# EasyEDA schematic SCH_d_01_ex_01.json

## Sheets
1 EX01_0: TITLE: Sheet_1; REV: 1.0; Date: 2025-01-14; Sheet: 1/1; Drawn By: artem.v.ulyanov; Company: Your Company
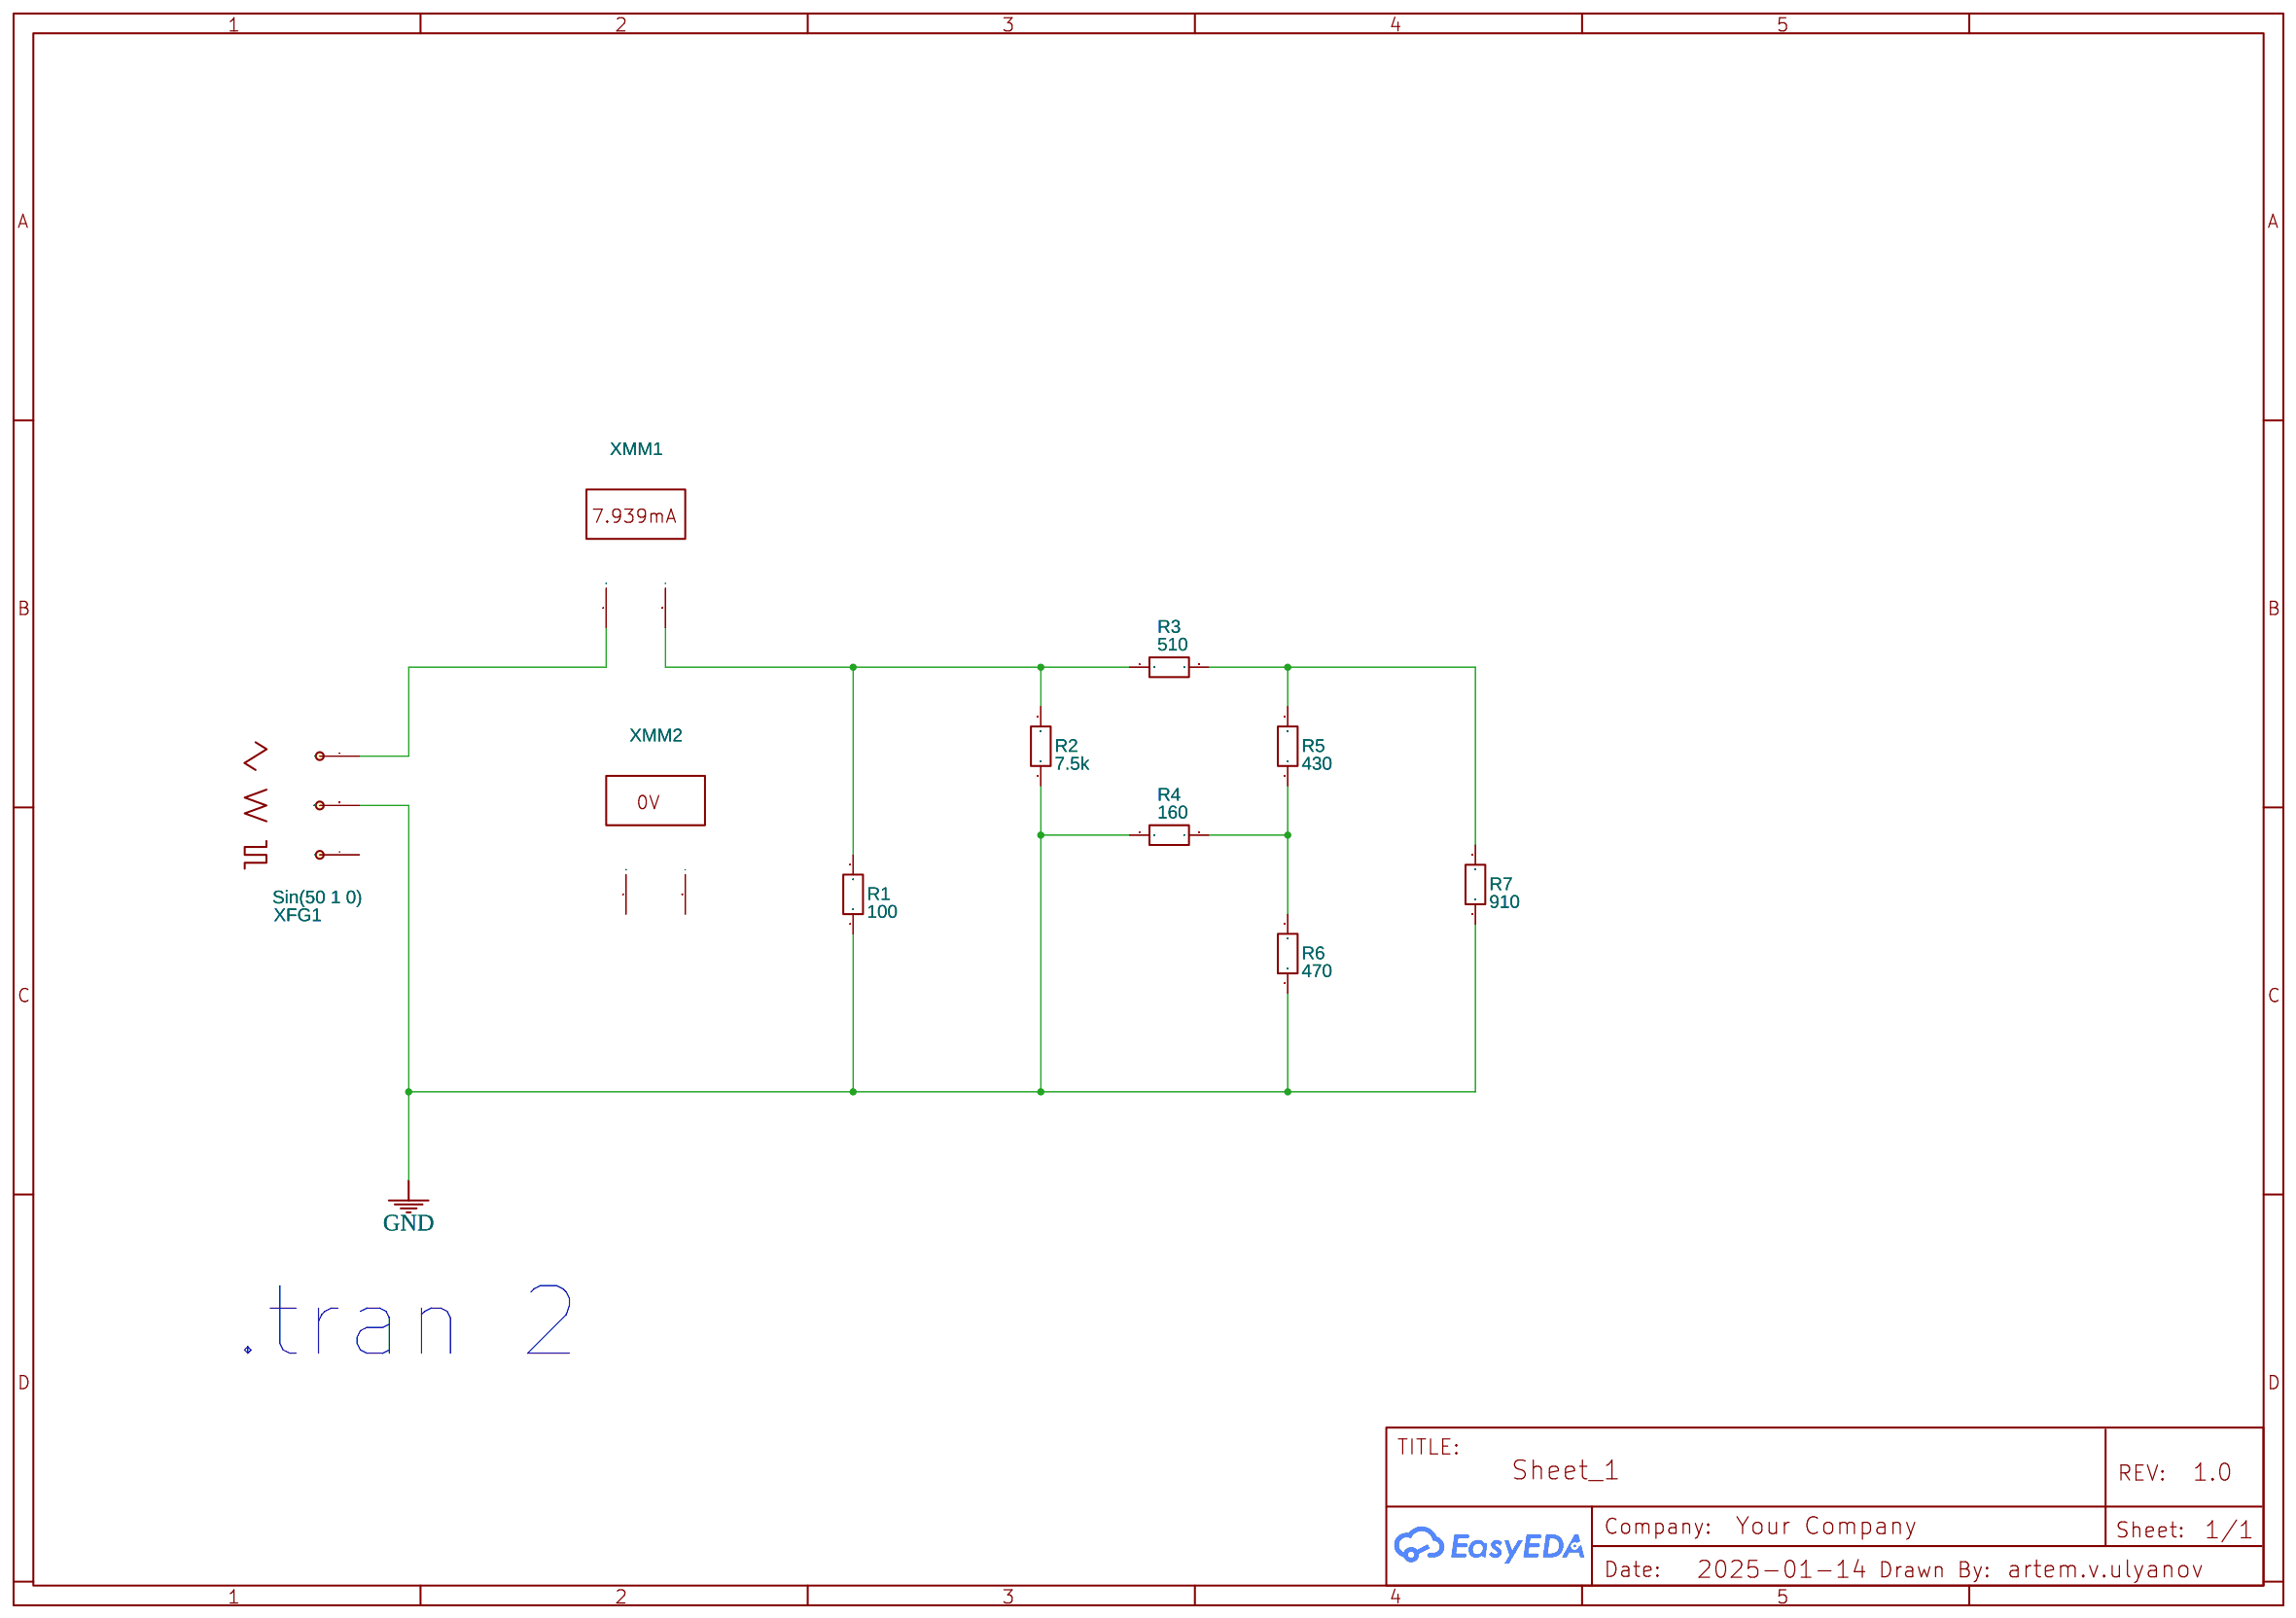
[diagram p0: EX01_0]
2 EX01_1
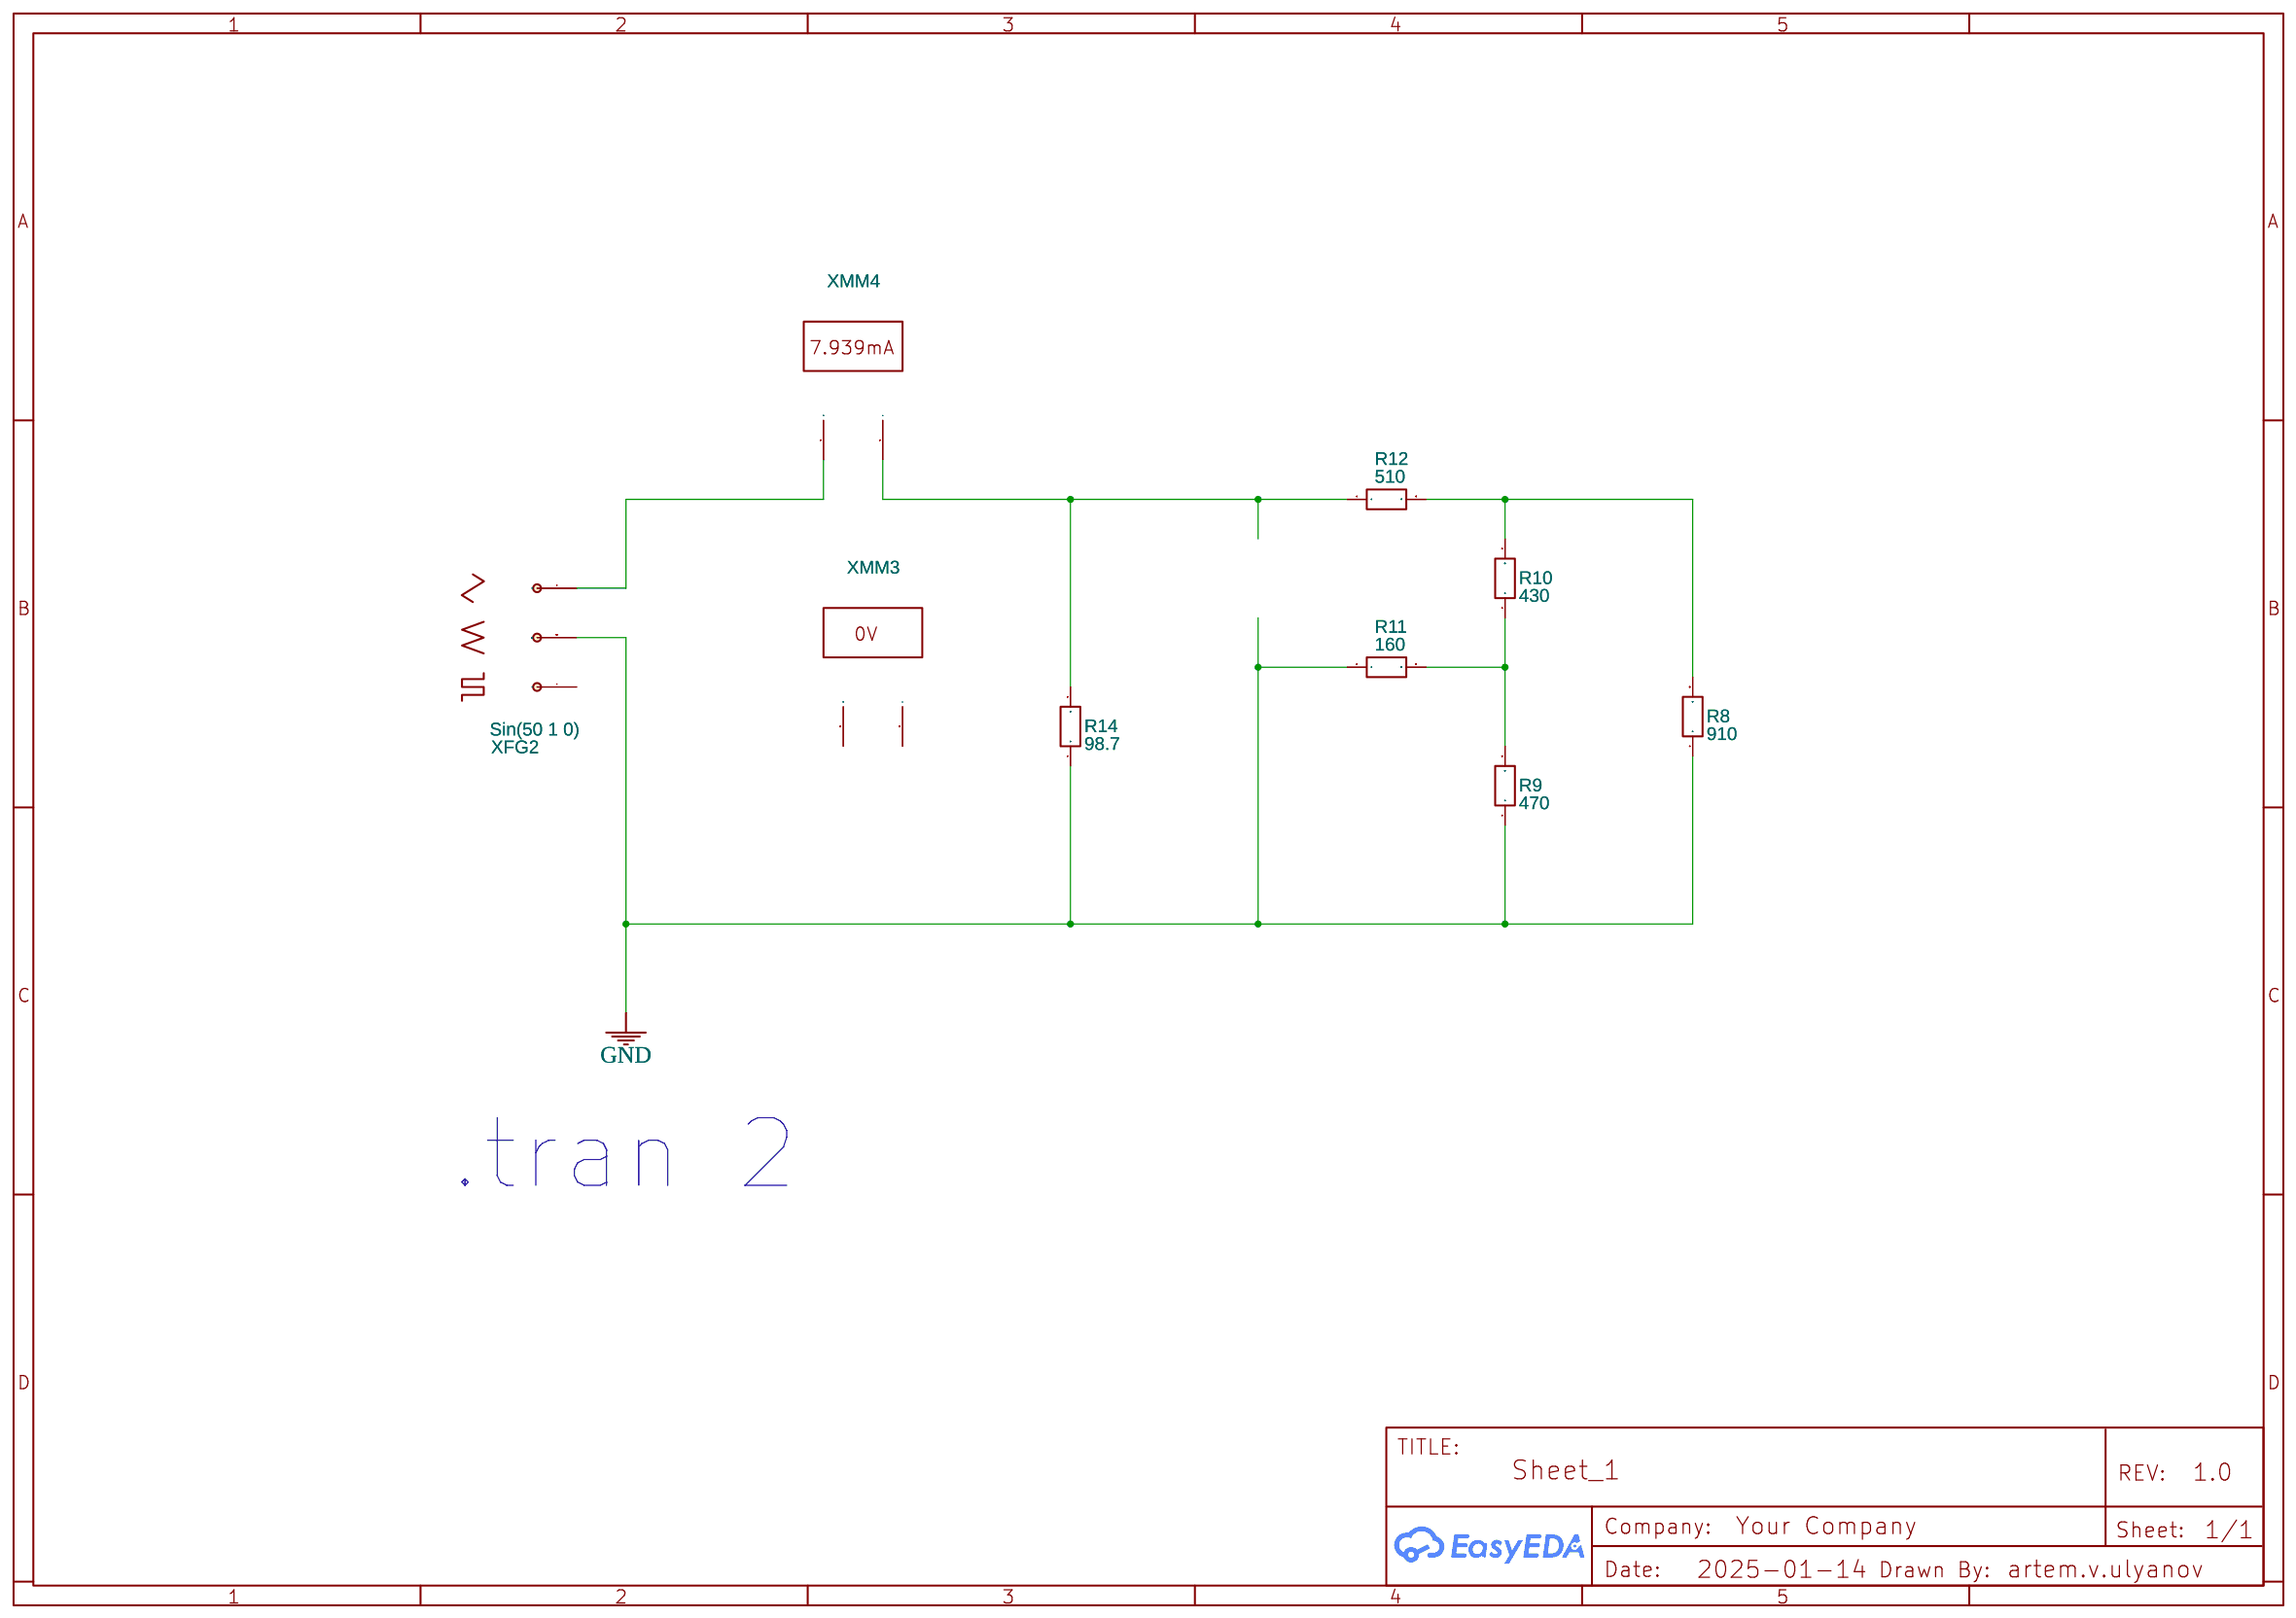
[diagram p1: EX01_1]
3 EX01_2
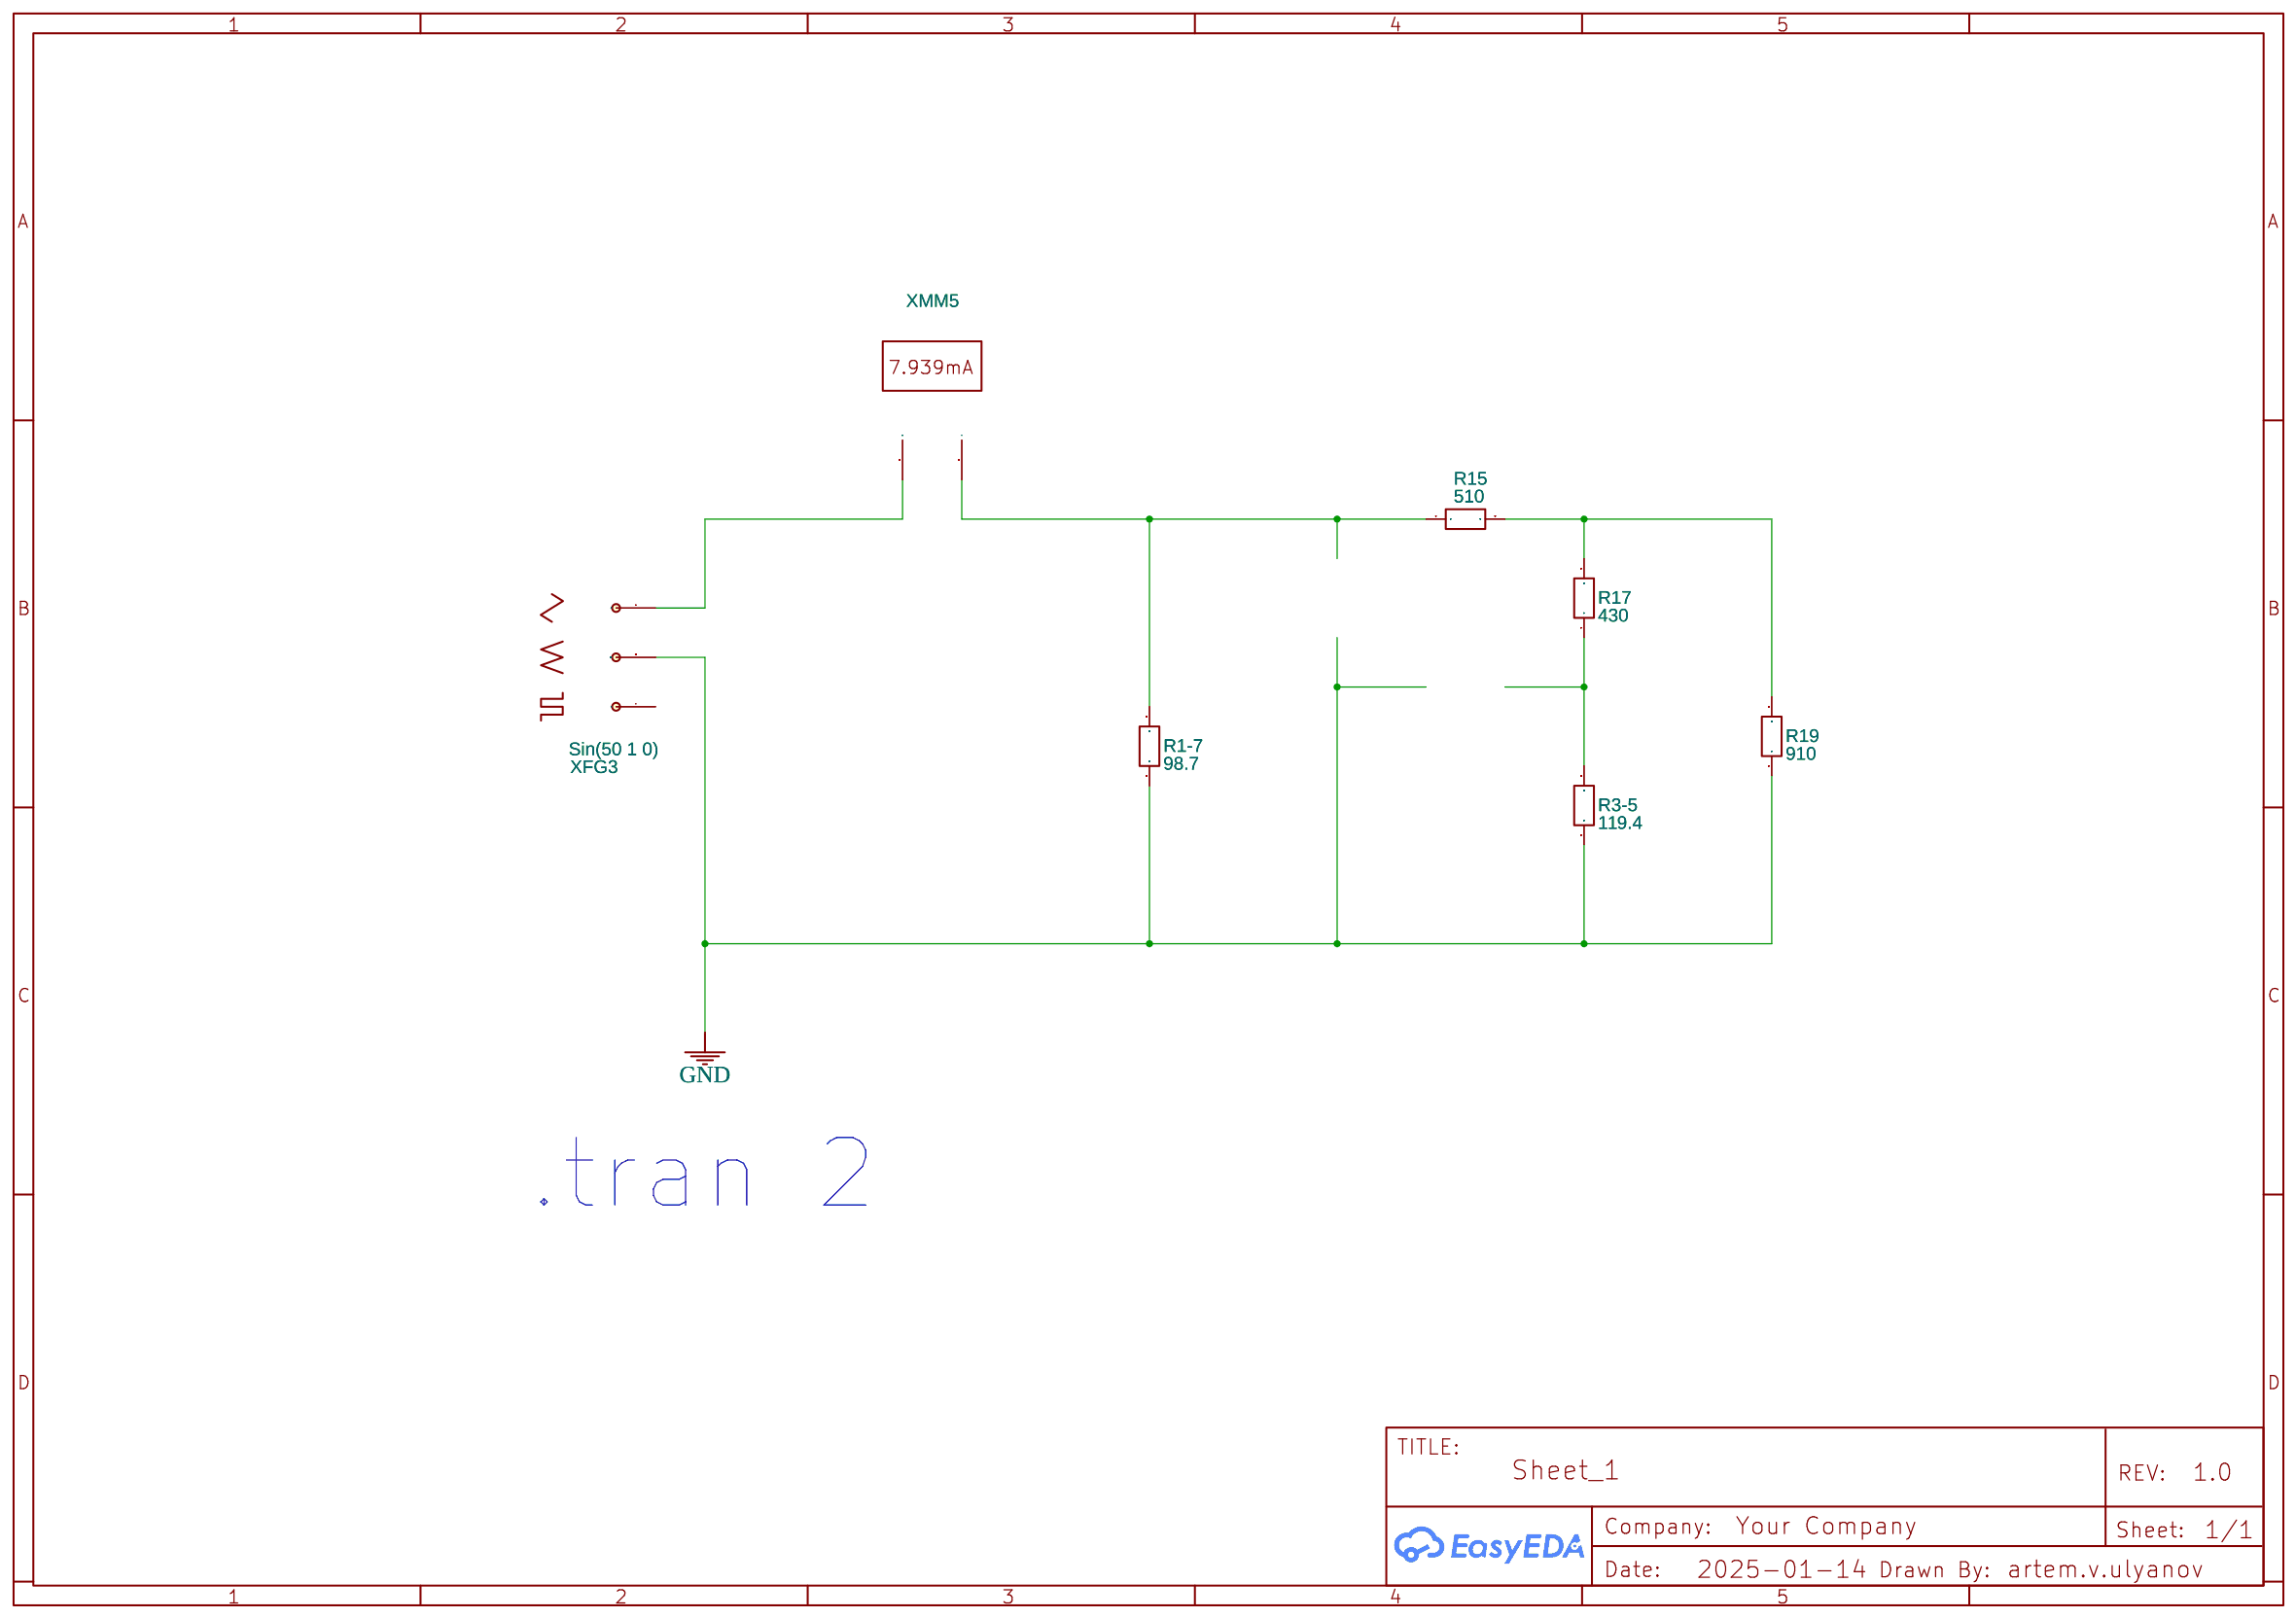
[diagram p2: EX01_2]
4 EX01_3
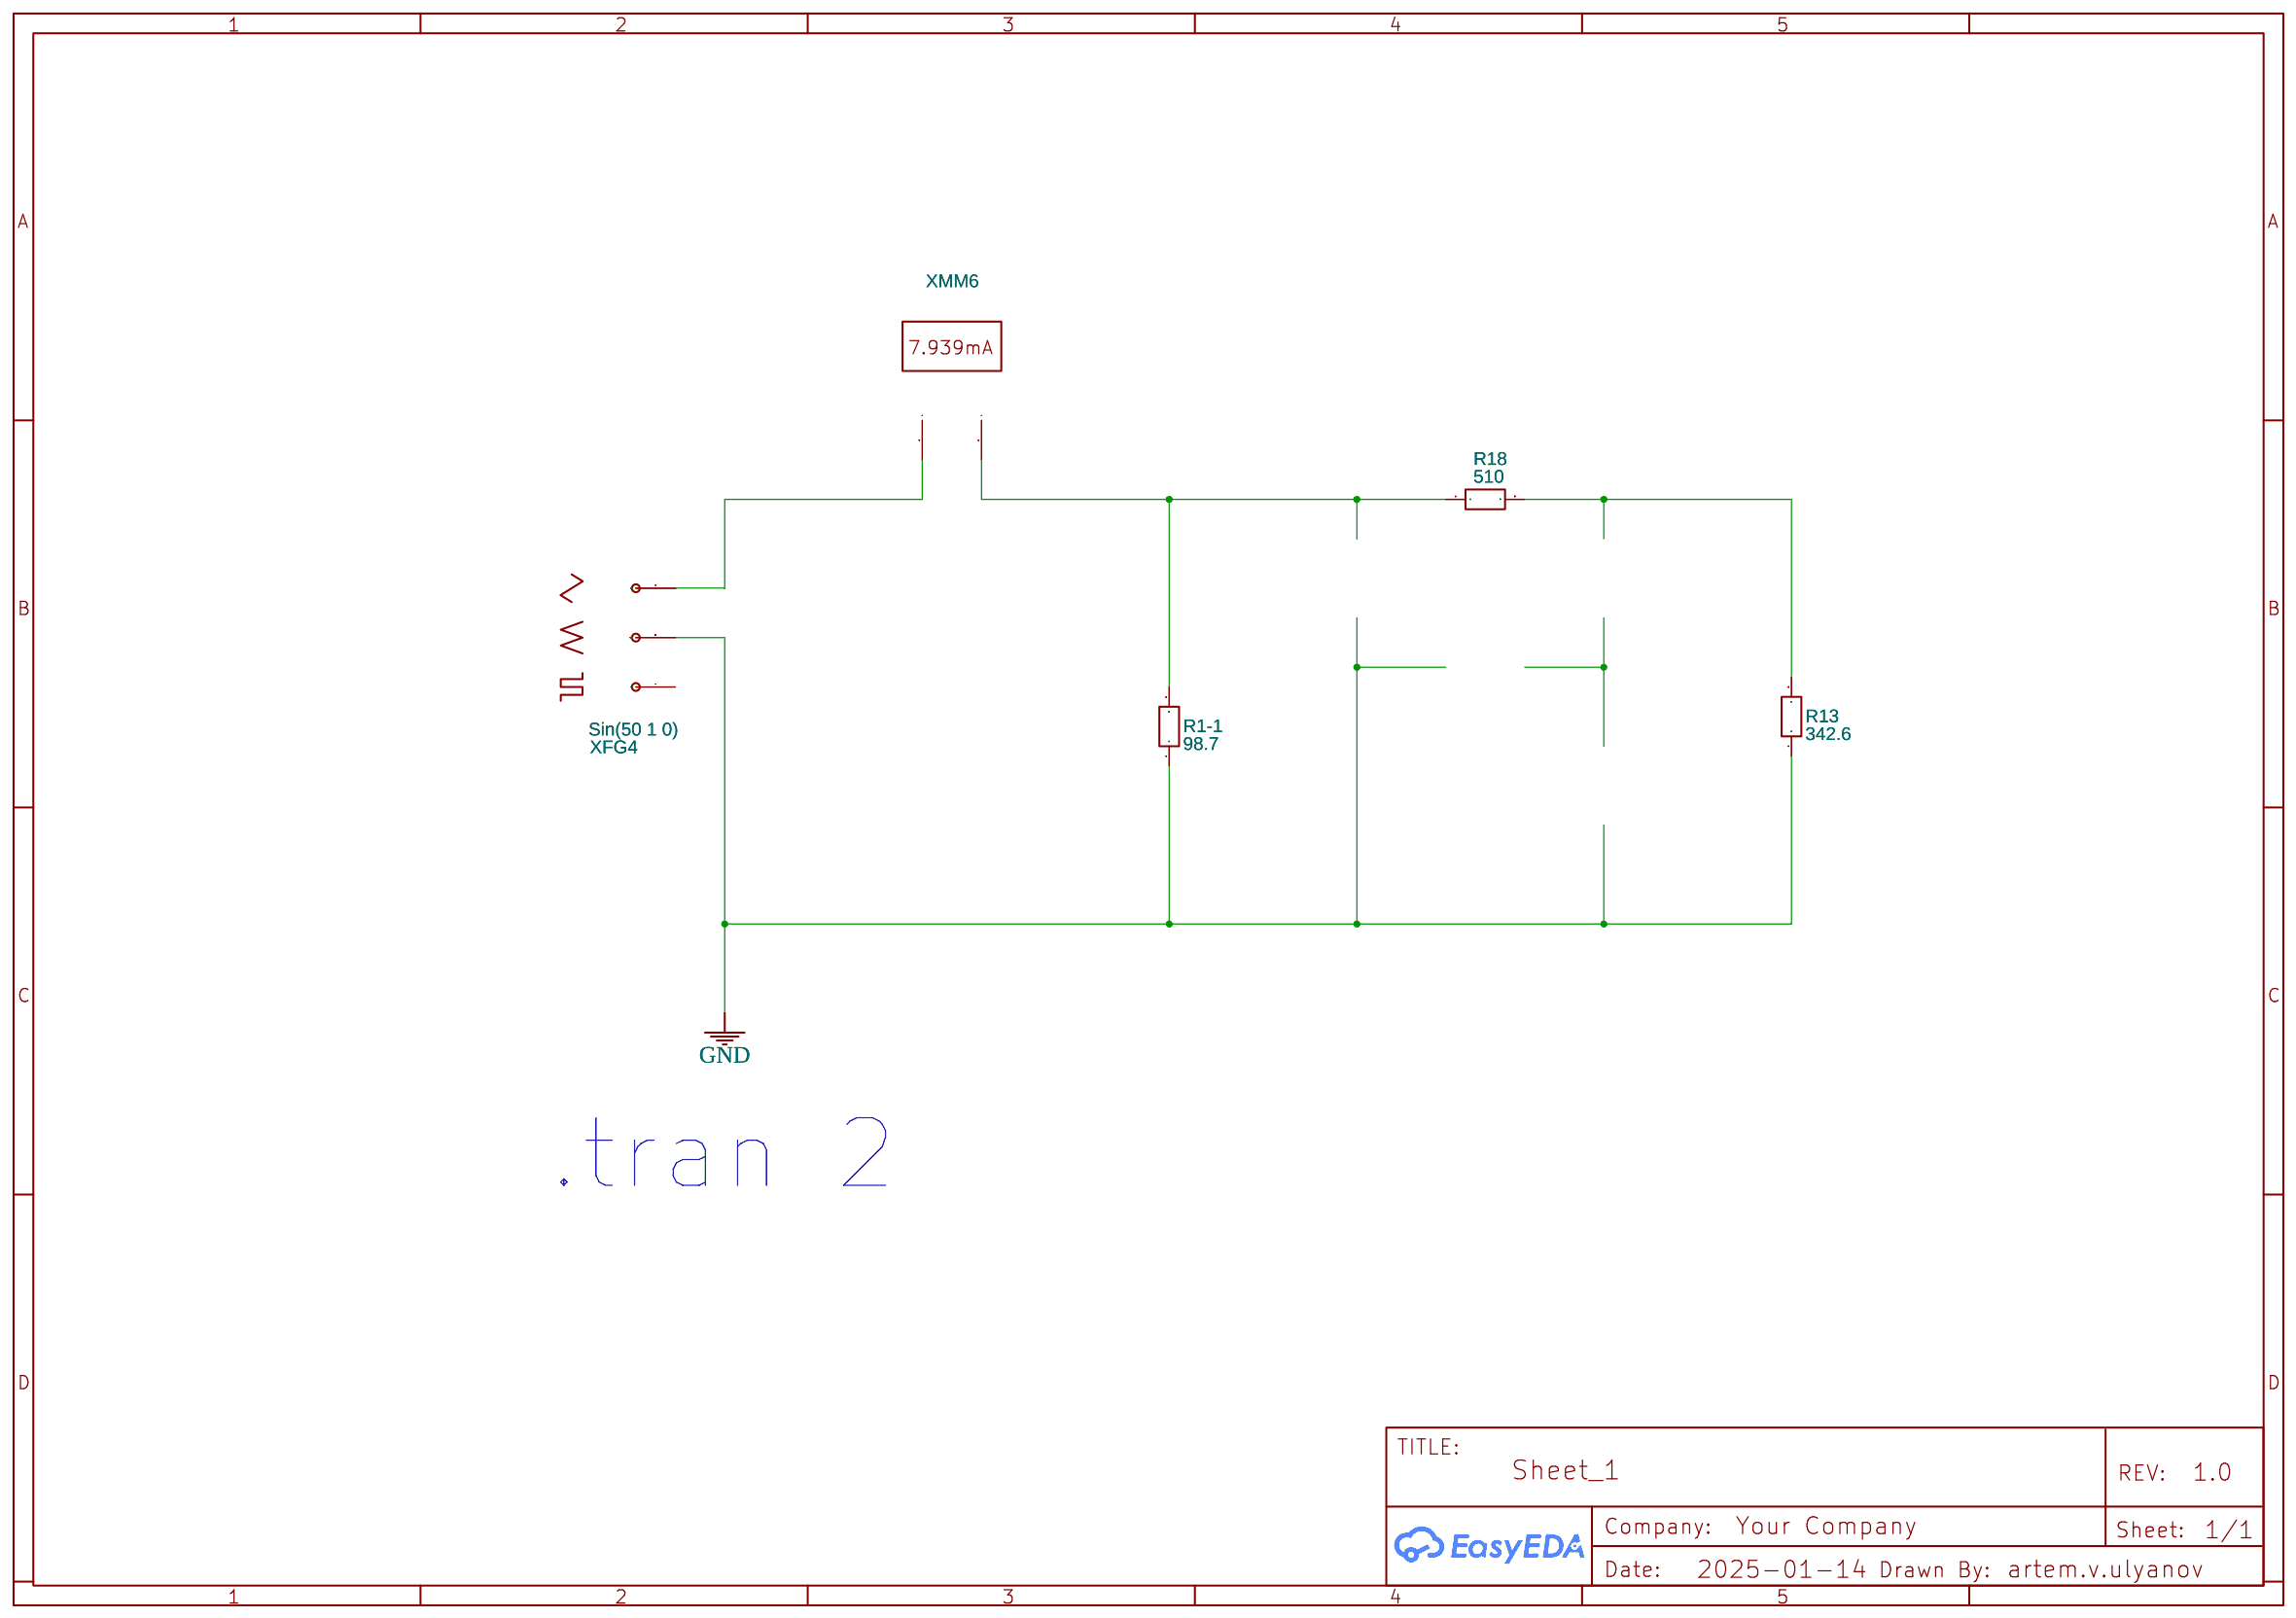
[diagram p3: EX01_3]
5 EX01_4
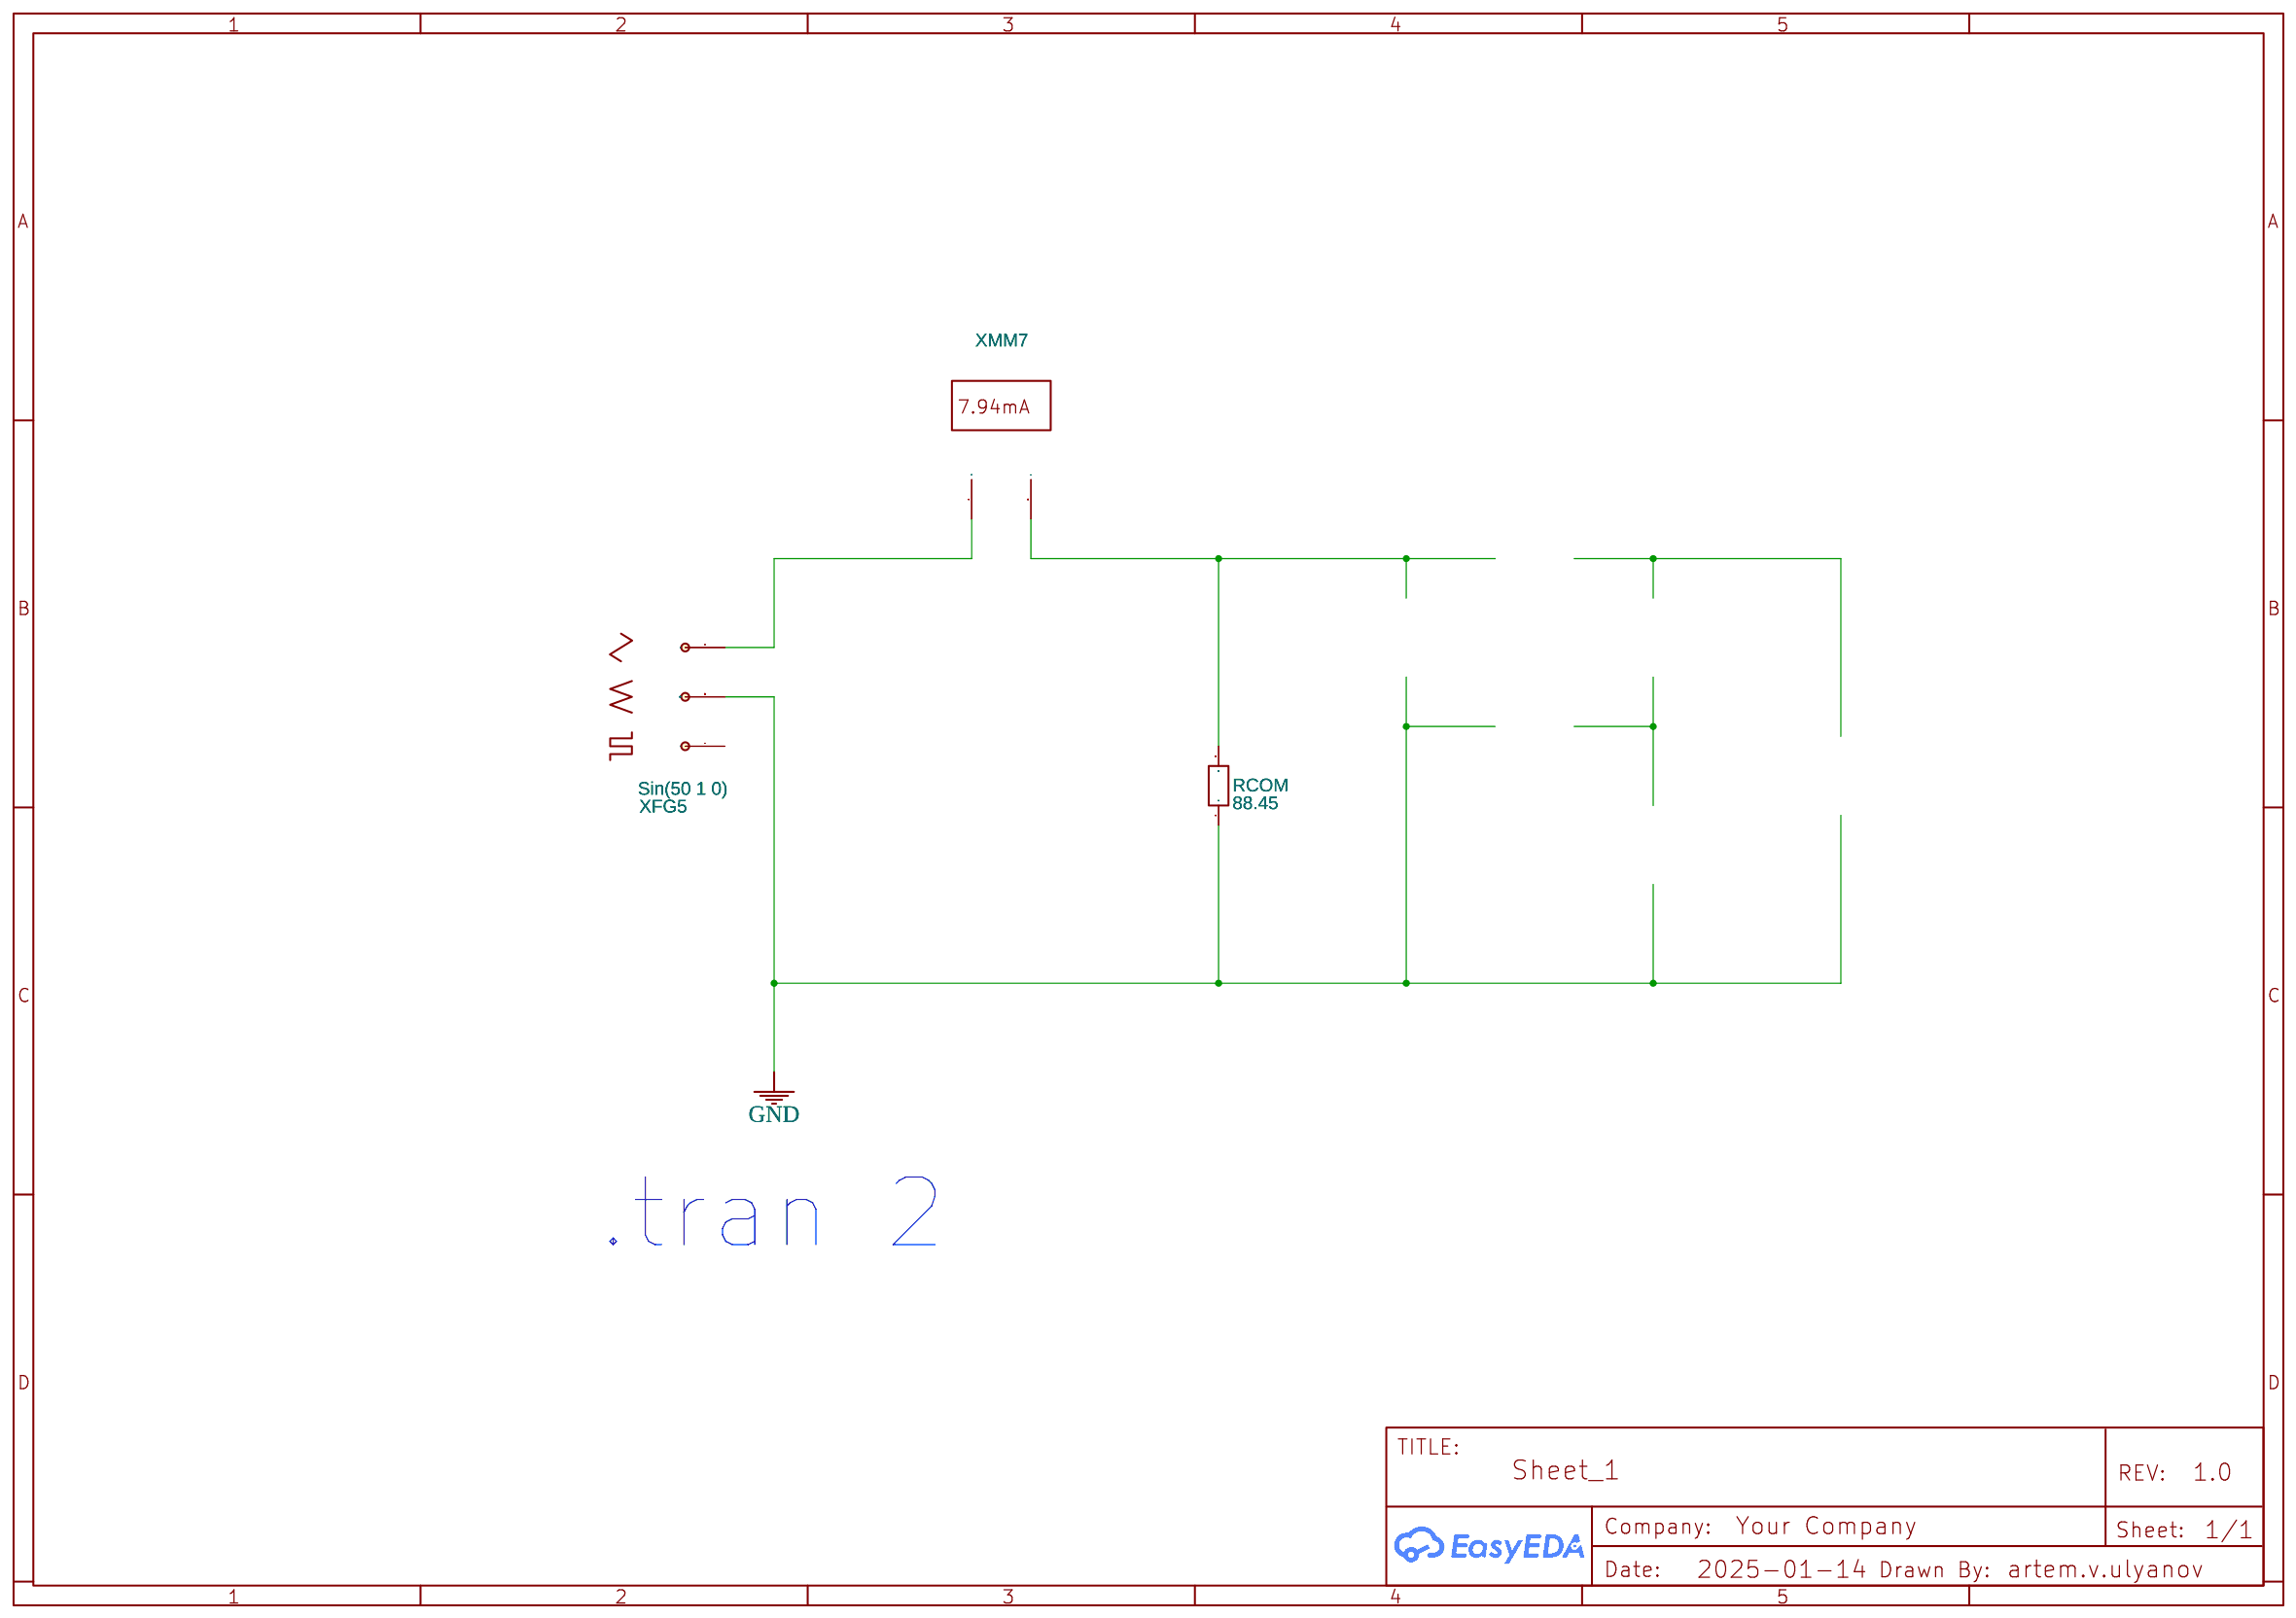
[diagram p4: EX01_4]

## Parts
sheet EX01_0
R1  100  [R0603]
R2  7.5k  [R0603]
R3  510  [R0603]
R4  160  [R0603]
R5  430  [R0603]
R6  470  [R0603]
R7  910  [R0603]
XFG1  Sin(50 1 0)
XMM1  Multimeter
XMM2  Multimeter
sheet EX01_1
R8  910  [R0603]
R9  470  [R0603]
R10  430  [R0603]
R11  160  [R0603]
R12  510  [R0603]
R14  98.7  [R0603]
XFG2  Sin(50 1 0)
XMM3  Multimeter
XMM4  Multimeter
sheet EX01_2
R1-7  98.7  [R0603]
R3-5  119.4  [R0603]
R15  510  [R0603]
R17  430  [R0603]
R19  910  [R0603]
XFG3  Sin(50 1 0)
XMM5  Multimeter
sheet EX01_3
R1-1  98.7  [R0603]
R13  342.6  [R0603]
R18  510  [R0603]
XFG4  Sin(50 1 0)
XMM6  Multimeter
sheet EX01_4
RCOM  88.45  [R0603]
XFG5  Sin(50 1 0)
XMM7  Multimeter

## Library data of the parts
R1 R1-1 R1-7 R2 R3 R3-5 R4-R15 R17-R19 RCOM = R_0603_EU: Contributor: LCEDA_Lib
XFG1-XFG5 = FUNCTIONGENERATOR: Supplier: LCSC; Waveforms: Sine Wave; Frequency: 50; Duty cycle: 50; Amplitude: 1; Offset: 0; Rise/Fall Time: 10; NameDisplay: 1; Contributor: EasyEDA; sim: true
XMM1 XMM4-XMM7 = MULTIMETER: Supplier: LCSC; Multimeter Type: Amper; Power Type: AC; Voltmeter resistance: 10μ; Ammeter resistance: 1G; NameDisplay: 0; Contributor: EasyEDA; sim: true
XMM2 XMM3 = MULTIMETER: Supplier: LCSC; Multimeter Type: Voltmeter; Power Type: AC; Voltmeter resistance: 10μ; Ammeter resistance: 1G; NameDisplay: 0; Contributor: EasyEDA; sim: true

## Nets
GND: R1.1 R1-1.1 R1-7.1 R2.1 R3-5.1 R4.1 R6.1 R7.1 R8.1 R9.1 R11.1 R13.1 R14.1 R19.1 RCOM.1 XFG1.COM XFG2.COM XFG3.COM XFG4.COM XFG5.COM
Net-(R1-1-2): R1-1.2 R18.1 XMM6.2(I)
Net-(R1-2): R1.2 R2.2 R3.1 XMM1.2(I)
Net-(R1-7-2): R1-7.2 R15.1 XMM5.2(I)
Net-(R3-2): R3.2 R5.2 R7.2
Net-(R3-5-2): R3-5.2 R17.1
Net-(R4-2): R4.2 R5.1 R6.2
Net-(R8-2): R8.2 R10.2 R12.2
Net-(R9-2): R9.2 R10.1 R11.2
Net-(R12-1): R12.1 R14.2 XMM4.2(I)
Net-(R13-2): R13.2 R18.2
Net-(R15-2): R15.2 R17.2 R19.2
Net-(RCOM-2): RCOM.2 XMM7.2(I)
Net-(XFG1-+): XFG1.+ XMM1.1(+)
Net-(XFG2-+): XFG2.+ XMM4.1(+)
Net-(XFG3-+): XFG3.+ XMM5.1(+)
Net-(XFG4-+): XFG4.+ XMM6.1(+)
Net-(XFG5-+): XFG5.+ XMM7.1(+)

Not connected (* = marked no-connect by the designer): XFG1 -; XFG2 -; XFG3 -; XFG4 -; XFG5 -; XMM2 1(+) 2(I); XMM3 1(+) 2(I)

## Notes on the sheets
sheet 1
- .tran 2
sheet 2
- .tran 2
sheet 3
- .tran 2
sheet 4
- .tran 2
sheet 5
- .tran 2
